# Altium schematic sheet Pulsadores.SchDoc
size A4; SheetNumber: 6; SheetTotal: 8
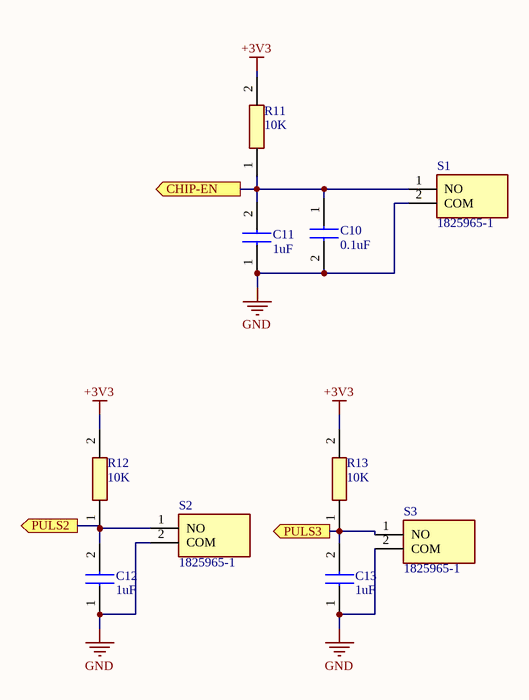
[diagram p0: Pulsadores.SchDoc]

## Parts
C10  0.1uF  [CAPC3216X100N]
C11  1uF  [CAPC3216X100N]
C12  1uF  [CAPC3216X100N]
C13  1uF  [CAPC3216X100N]
R11  10K  [RESC3216X75N]
R12  10K  [RESC3216X75N]
R13  10K  [RESC3216X75N]
S1  1825965-1  [TAC-SWITCH 2CONT. 3,5X6MM]
S2  1825965-1  [TAC-SWITCH 2CONT. 3,5X6MM]
S3  1825965-1  [TAC-SWITCH 2CONT. 3,5X6MM]

## Ports
CHIP-EN (out), PULS2 (out), PULS3 (out)

## Nets
+3V3: R11.2 R12.2 R13.2
GND: C10.2 C11.1 C12.1 C13.1 S1.2(COM) S2.2(COM) S3.2(COM)
CHIP-EN: C10.1 C11.2 R11.1 S1.1(NO) ; port CHIP-EN
PULS2: C12.2 R12.1 S2.1(NO) ; port PULS2
PULS3: C13.2 R13.1 S3.1(NO) ; port PULS3

## Library data of the parts
C10-C13 = CL31B104KBCNNNC: 100NFX50V X7R 10% CER.MULT. SMD 1206; Manufacturer_Name: Samsung Electro-Mechanics; Datasheet Link: https://datasheet.datasheetarchive.com/originals/distributors/Datasheets_SAMA/0fdb6a11e020a7299f4d0713dd2bd7ee.pdf; Height: 1mm; Manufacturer_Part_Number: CL31B104KBCNNNC; Mouser Part Number: 187-CL31B104KBCNNNC; Mouser Price/Stock: https://www.mouser.co.uk/ProductDetail/Samsung-Electro-Mechanics/CL31B104KBCNNNC?qs=349EhDEZ59oHABbyGq1iKA%3D%3D; Arrow Part Number: CL31B104KBCNNNC; Arrow Price/Stock: https://www.arrow.com/en/products/cl31b104kbcnnnc/samsung-electro-mechanics?region=nac
R11-R13 = CR1206-F_-2R00ELF: Resistor; Manufacturer_Name: Bourns; Manufacturer_Part_Number: CR1206-F/-2R00ELF; Height: 0.75mm; Mouser Part Number: 652-CR1206-F/2R00ELF; Mouser Price/Stock: https://www.mouser.co.uk/ProductDetail/Bourns/CR1206-F-2R00ELF?qs=W%2FMpXkg%252BdQ47Z%2FeZv1nDSg%3D%3D
S1-S3 = 1825965-1: Switch; Manufacturer_Name: TE Connectivity; Datasheet Link: https://www.arrow.com/en/products/1825965-1/te-connectivity; Height: 5mm; Manufacturer_Part_Number: 1825965-1; Arrow Part Number: 1825965-1; Arrow Price/Stock: https://www.arrow.com/en/products/1825965-1/te-connectivity?region=nac